# Altium project timer.PrjPcb
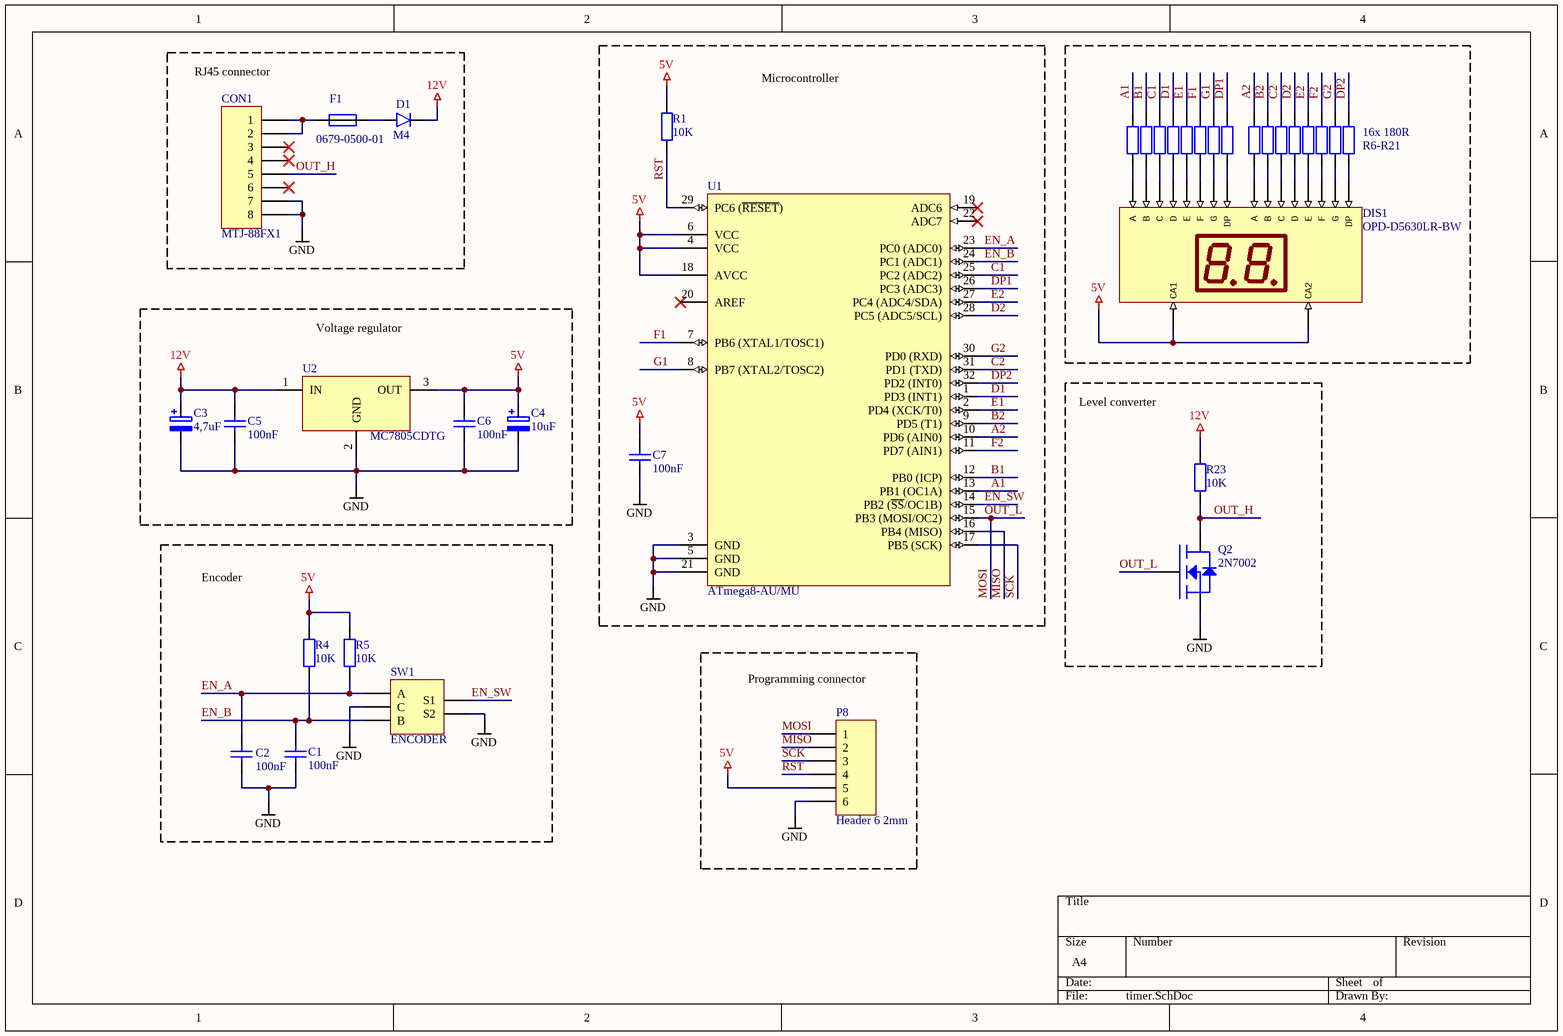
[diagram p0: timer.SchDoc]
1 sheet, 36 parts. Net scope: global (net labels, ports and power ports of the same name join across sheets).
Board file: timer.PcbDoc

## Sheet timer.SchDoc
size A4

### Parts
C1  100nF  [C0805]
C2  100nF  [C0805]
C3  4,7uF  [TANC_B]
C4  10uF  [TANC_B]
C5  100nF  [C0805]
C6  100nF  [C0805]
C7  100nF  [C0805]
CON1  MTJ-88FX1  [MTJ-88FX1]
D1  M4  [SMA]
DIS1  OPD-D5630LR-BW  [OPD-D5631LR-BW]
F1  0679-0500-01  [0679-0500-01]
P8  Header 6 2mm  [MA06-1_2mm]
Q2  2N7002  [SOT23]
R1  10K  [R0805]
R4  10K  [R0805]
R5  10K  [R0805]
R6  180R  [R0805]  (value not drawn)
R7  180R  [R0805]  (value not drawn)
R8  180R  [R0805]  (value not drawn)
R9  180R  [R0805]  (value not drawn)
R10  180R  [R0805]  (value not drawn)
R11  180R  [R0805]  (value not drawn)
R12  180R  [R0805]  (value not drawn)
R13  180R  [R0805]  (value not drawn)
R14  180R  [R0805]  (value not drawn)
R15  180R  [R0805]  (value not drawn)
R16  180R  [R0805]  (value not drawn)
R17  180R  [R0805]  (value not drawn)
R18  180R  [R0805]  (value not drawn)
R19  180R  [R0805]  (value not drawn)
R20  180R  [R0805]  (value not drawn)
R21  180R  [R0805]  (value not drawn)
R23  10K  [R0805]
SW1  ENCODER  [EC12E20-24P24C-SW]
U1  ATmega8-AU/MU  [TQFP-32A]
U2  MC7805CDTG  [TO-252]

### Blocks framed on the sheet
RJ45 connector: CON1 D1 F1
Voltage regulator: C3-C6 U2
Level converter: Q2 R23
Encoder: C1 C2 R4 R5 SW1
Programming connector: P8

### Nets
5V: C4.1 C6.1 C7.1 DIS1.13(CA2) DIS1.14(CA1) P8.5 R1.1 R4.2 R5.2 U1.4(VCC) U1.6(VCC) U1.18(AVCC) U2.3(OUT)
12V: C3.1 C5.1 D1.1 R23.2 U2.1(IN)
GND: C1.2 C2.2 C3.2 C4.2 C5.2 C6.2 C7.2 CON1.7 CON1.8 P8.6 Q2.2(S) SW1.C SW1.S2 U1.3(GND) U1.5(GND) U1.21(GND) U2.2(GND)
A1: R6.2 U1.13(PB1_(OC1A))
A2: R14.2 U1.10(PD6_(AIN0))
B1: R7.2 U1.12(PB0_(ICP))
B2: R15.2 U1.9(PD5_(T1))
C1: R8.2 U1.25(PC2_(ADC2))
C2: R16.2 U1.31(PD1_(TXD))
D1: R9.2 U1.1(PD3_(INT1))
D2: R17.2 U1.28(PC5_(ADC5/SCL))
DP1: R13.2 U1.26(PC3_(ADC3))
DP2: R21.2 U1.32(PD2_(INT0))
E1: R10.2 U1.2(PD4_(XCK/T0))
E2: R18.2 U1.27(PC4_(ADC4/SDA))
EN_A: C2.1 R5.1 SW1.A U1.23(PC0_(ADC0))
EN_B: C1.1 R4.1 SW1.B U1.24(PC1_(ADC1))
EN_SW: SW1.S1 U1.14(PB2_(~{SS}/OC1B))
F1: R11.2 U1.7(PB6_(XTAL1/TOSC1))
F2: R19.2 U1.11(PD7_(AIN1))
G1: R12.2 U1.8(PB7_(XTAL2/TOSC2))
G2: R20.2 U1.30(PD0_(RXD))
MISO: P8.2 U1.16(PB4_(MISO))
MOSI: P8.1 Q2.1(G) U1.15(PB3_(MOSI/OC2))  [also labelled OUT_L]
OUT_H: CON1.5 Q2.3(D) R23.1
RST: P8.4 R1.2 U1.29(PC6_(~{RESET}))
SCK: P8.3 U1.17(PB5_(SCK))
NetCON1_1: CON1.1 CON1.2 F1.1
NetD1_2: D1.2 F1.2
NetDIS1_1: DIS1.1(E) R10.1
NetDIS1_2: DIS1.2(D) R9.1
NetDIS1_3: DIS1.3(C) R8.1
NetDIS1_4: DIS1.4(DP) R13.1
NetDIS1_5: DIS1.5(E) R18.1
NetDIS1_6: DIS1.6(D) R17.1
NetDIS1_7: DIS1.7(G) R20.1
NetDIS1_8: DIS1.8(C) R16.1
NetDIS1_9: DIS1.9(DP) R21.1
NetDIS1_10: DIS1.10(B) R15.1
NetDIS1_11: DIS1.11(A) R14.1
NetDIS1_12: DIS1.12(F) R19.1
NetDIS1_15: DIS1.15(B) R7.1
NetDIS1_16: DIS1.16(A) R6.1
NetDIS1_17: DIS1.17(G) R12.1
NetDIS1_18: DIS1.18(F) R11.1

Not connected (* = marked no-connect by the designer): CON1 3* 4* 6*; U1 19(ADC6)* 20(AREF)* 22(ADC7)*

### Notes on the sheet
- Microcontroller
- (near R21) 16x 180R
- (near R21) R6-R21

### Library data of the parts
C1 C2 C5-C7 = Cap: Capacitor
C3 C4 = Cap_Pol: Capacitor Polarized
D1 = Diode
DIS1 = 2x8SEGMENTS
F1 = 0679-0500-01: Bezpiecznik: topikowy; szybki; ceramiczny; 500mA; 125VAC; 125VDC
P8 = Header 6: Header, 6-Pin
Q2 = 2N7002(GSD): N-MOSFET
R1 R4-R21 R23 = Res: Resistor
SW1 = ENCODER: EC12E20-24P24C-SW
U1 = ATmega8-AU/MU: TQFP - 32pin / MLF - 32pin; DatasheetVersion: revZ, Feb-2011; PackageVersion: revC, Oct-2010; PackageReference: 32A; PackageDescription: 32-Lead, 7x7x1.0 mm Body, 0.8mm Lead Pitch, Thin Profile Plastic Quad Flat Package (TQFP); Code_JEDEC: MS-026-ABA; ComponentLink1Description: Manufacturer URL; ComponentLink1URL: http://www.atmel.com/; ComponentLink2Description: ATmega8(L); ComponentLink2URL: http://www.atmel.com/dyn/resources/prod_documents/doc2486.pdf; ComponentLink3Description: ATmega8(L) Summary; ComponentLink3URL: http://www.atmel.com/dyn/resources/prod_documents/2486S.pdf
U2 = 78xx